# EasyEDA schematic sch_buttons.json
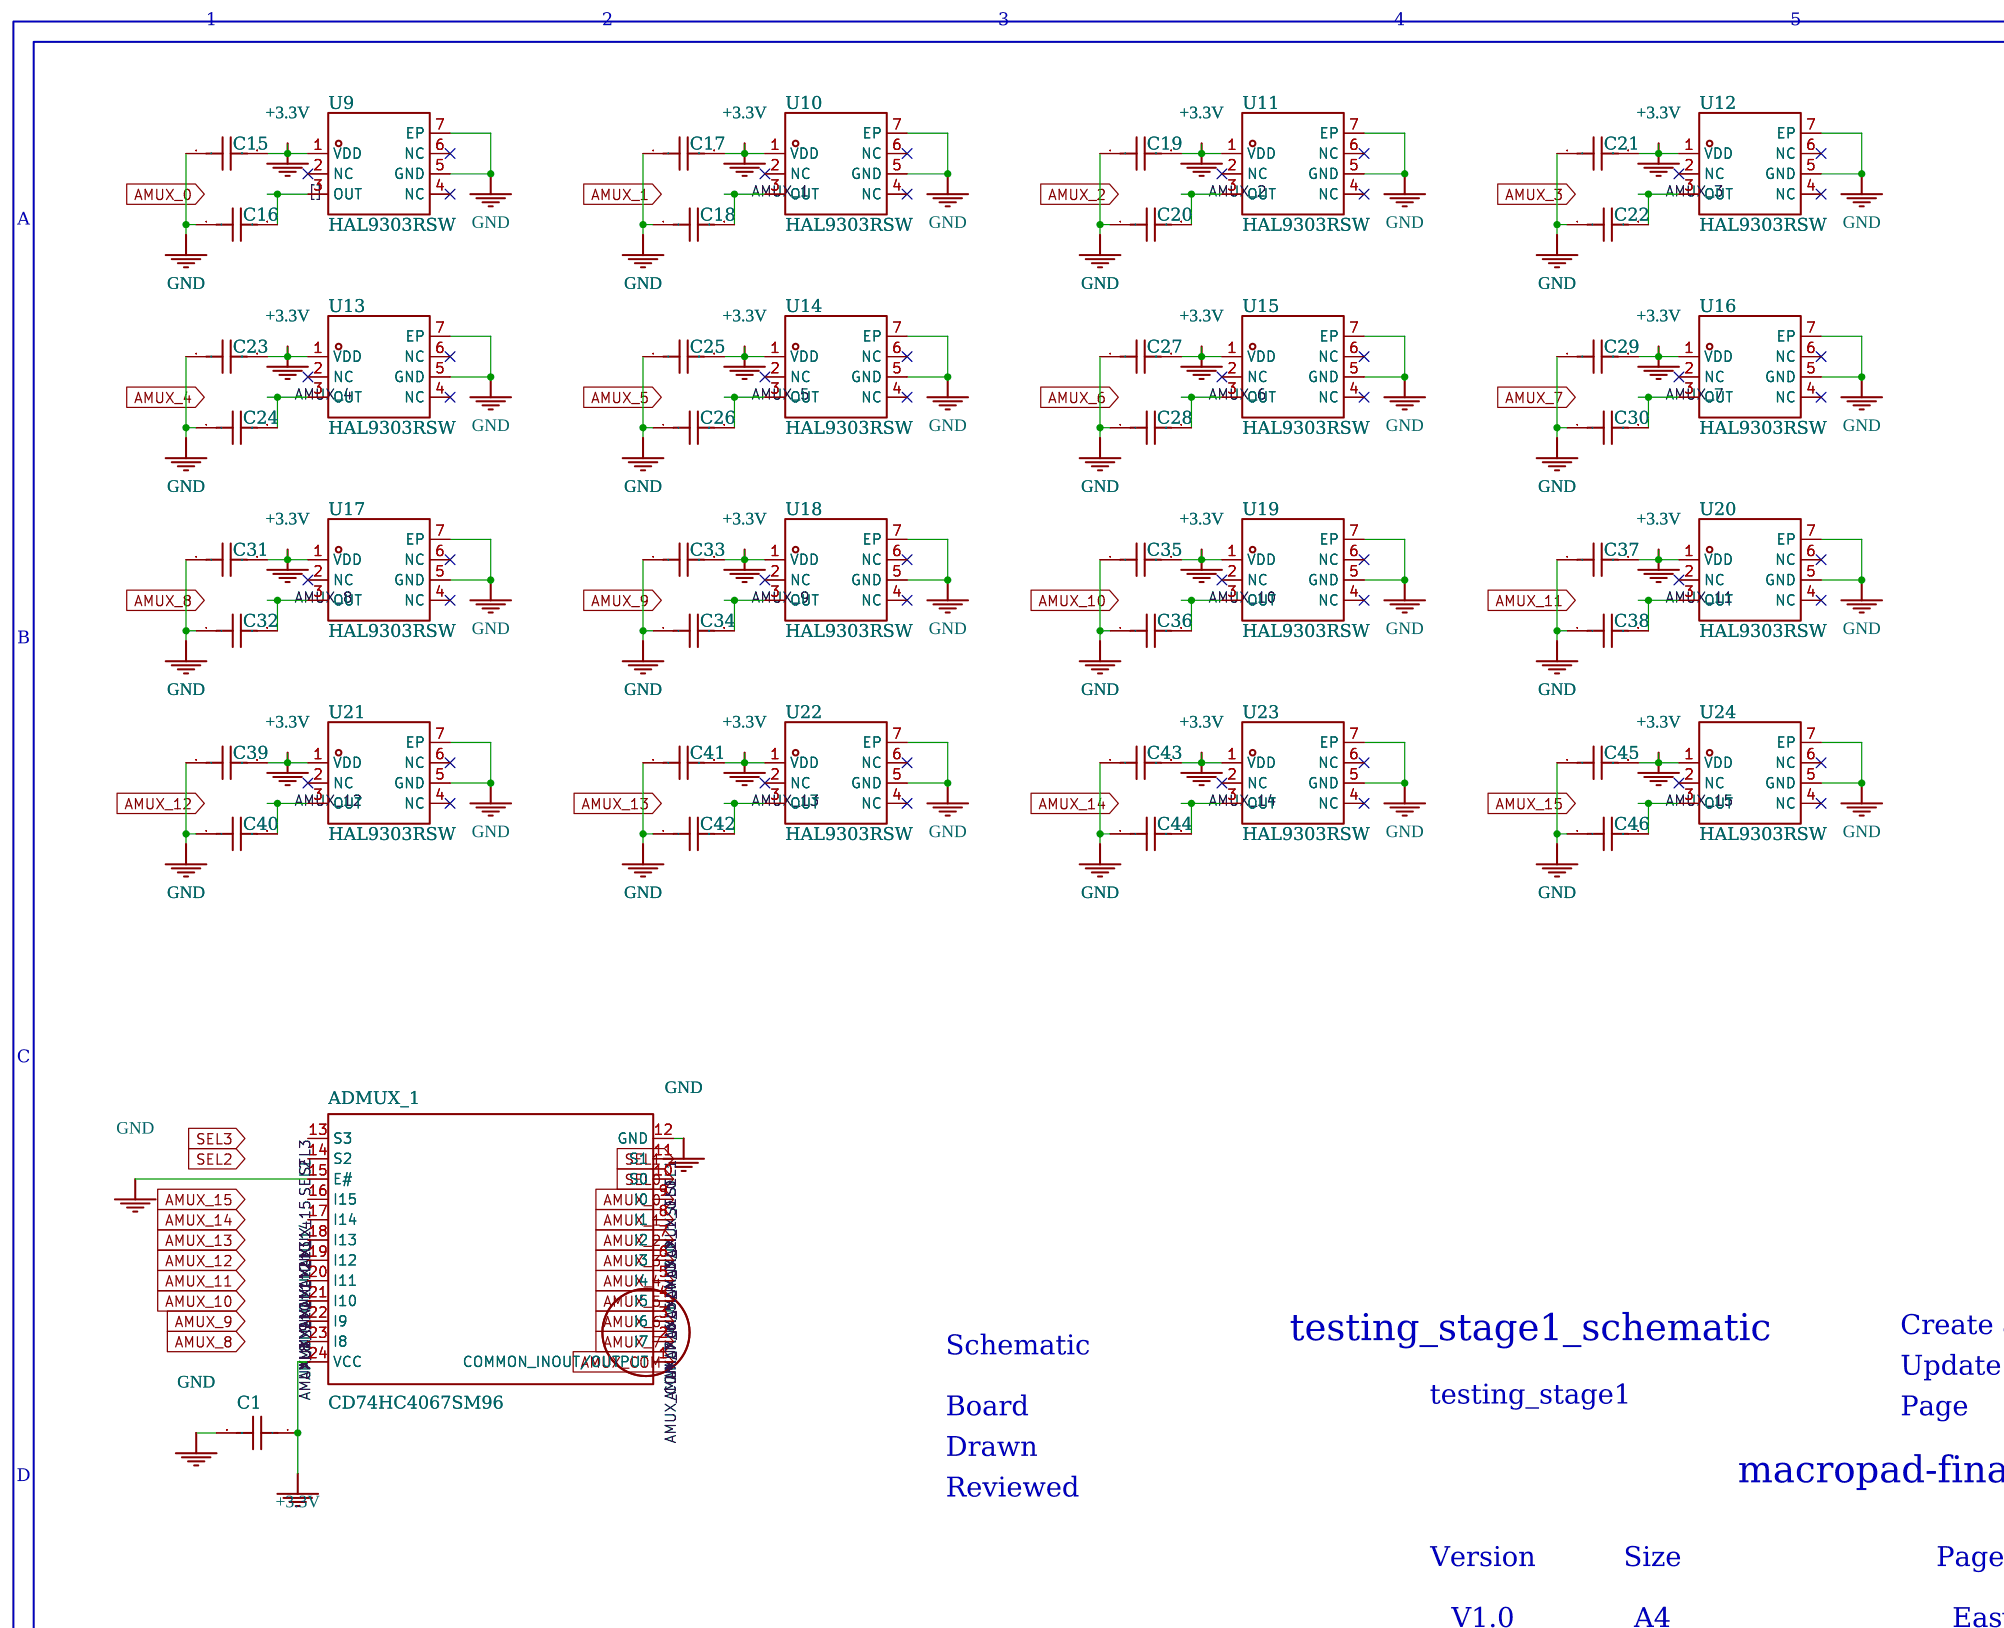
[diagram p0: schematic sheet]

## Parts
ADMUX_1  CD74HC4067SM96  [SSOP-24_L8.1-W5.3-P0.65-LS7.8-BL]
C1  100nF  [C0201]
C15  100nF  [C0201]
C16  100nF  [C0201]
C17  100nF  [C0201]
C18  100nF  [C0201]
C19  100nF  [C0201]
C20  100nF  [C0201]
C21  100nF  [C0201]
C22  100nF  [C0201]
C23  100nF  [C0201]
C24  100nF  [C0201]
C25  100nF  [C0201]
C26  100nF  [C0201]
C27  100nF  [C0201]
C28  100nF  [C0201]
C29  100nF  [C0201]
C30  100nF  [C0201]
C31  100nF  [C0201]
C32  100nF  [C0201]
C33  100nF  [C0201]
C34  100nF  [C0201]
C35  100nF  [C0201]
C36  100nF  [C0201]
C37  100nF  [C0201]
C38  100nF  [C0201]
C39  100nF  [C0201]
C40  100nF  [C0201]
C41  100nF  [C0201]
C42  100nF  [C0201]
C43  100nF  [C0201]
C44  100nF  [C0201]
C45  100nF  [C0201]
C46  100nF  [C0201]
U9  HAL9303RSW  [DFN1616-6_L1.6-W1.6-P0.50-BL-EP_RICOH_RP500X]
U10  HAL9303RSW  [DFN1616-6_L1.6-W1.6-P0.50-BL-EP_RICOH_RP500X]
U11  HAL9303RSW  [DFN1616-6_L1.6-W1.6-P0.50-BL-EP_RICOH_RP500X]
U12  HAL9303RSW  [DFN1616-6_L1.6-W1.6-P0.50-BL-EP_RICOH_RP500X]
U13  HAL9303RSW  [DFN1616-6_L1.6-W1.6-P0.50-BL-EP_RICOH_RP500X]
U14  HAL9303RSW  [DFN1616-6_L1.6-W1.6-P0.50-BL-EP_RICOH_RP500X]
U15  HAL9303RSW  [DFN1616-6_L1.6-W1.6-P0.50-BL-EP_RICOH_RP500X]
U16  HAL9303RSW  [DFN1616-6_L1.6-W1.6-P0.50-BL-EP_RICOH_RP500X]
U17  HAL9303RSW  [DFN1616-6_L1.6-W1.6-P0.50-BL-EP_RICOH_RP500X]
U18  HAL9303RSW  [DFN1616-6_L1.6-W1.6-P0.50-BL-EP_RICOH_RP500X]
U19  HAL9303RSW  [DFN1616-6_L1.6-W1.6-P0.50-BL-EP_RICOH_RP500X]
U20  HAL9303RSW  [DFN1616-6_L1.6-W1.6-P0.50-BL-EP_RICOH_RP500X]
U21  HAL9303RSW  [DFN1616-6_L1.6-W1.6-P0.50-BL-EP_RICOH_RP500X]
U22  HAL9303RSW  [DFN1616-6_L1.6-W1.6-P0.50-BL-EP_RICOH_RP500X]
U23  HAL9303RSW  [DFN1616-6_L1.6-W1.6-P0.50-BL-EP_RICOH_RP500X]
U24  HAL9303RSW  [DFN1616-6_L1.6-W1.6-P0.50-BL-EP_RICOH_RP500X]

## Library data of the parts
ADMUX_1 = -: LCSC Part Name: 高速CMOS逻辑16通道模拟多路复用器/解复用器; Supplier Part: C98457; Manufacturer: TI(德州仪器); Supplier Footprint: SSOP-24-208mil; JLCPCB Part Class: Extended Part; Datasheet: https://www.ti.com/cn/lit/gpn/cd74hc4067; Supplier: LCSC; Add into BOM: yes; Convert to PCB: yes; Number of Channels: 16; Supply Voltage: 2V6V; Turn-on time: 90ns; On-State Resistance (Max): 240Ω; Turn-off time: 87ns; Operating Temperature: -55℃+125℃
C1 C15-C46 = -: Symbol: TCC0201X7R104K160ZT; Device: TCC0201X7R104K160ZT; LCSC Part Name: 100nF ±10% 16V; Supplier Part: C18164586; Manufacturer: CCTC(三环); Manufacturer Part: TCC0201X7R104K160ZT; Supplier Footprint: 0201; JLCPCB Part Class: Extended Part; Datasheet: https://atta.szlcsc.com/upload/public/pdf/source/20191203/C466239_F62A586702D44EEA1C39B32FC8662B21.pdf; Supplier: LCSC; Add into BOM: yes; Convert to PCB: yes; Tolerance: ±10%; Voltage Rating: 16V; Temperature Coefficient: X7R
U9-U24 = -: Supplier Part: C42387472; Manufacturer: Hallwee(霍尔微电子); Supplier Footprint: DFN-6-EP(1.6x1.6); Datasheet: https://atta.szlcsc.com/upload/public/pdf/source/20241128/4D6AE4F8742D3C17AD5884A18EBEC5A8.pdf; Supplier: LCSC; Add into BOM: yes; Convert to PCB: yes

## Nets
+3.3V: ADMUX_1.24(VCC) C1.1 C15.2 C17.2 C19.2 C21.2 C23.2 C25.2 C27.2 C29.2 C31.2 C33.2 C35.2 C37.2 C39.2 C41.2 C43.2 C45.2 U9.1(VDD) U10.1(VDD) U11.1(VDD) U12.1(VDD) U13.1(VDD) U14.1(VDD) U15.1(VDD) U16.1(VDD) U17.1(VDD) U18.1(VDD) U19.1(VDD) U20.1(VDD) U21.1(VDD) U22.1(VDD) U23.1(VDD) U24.1(VDD)
GND: ADMUX_1.12(GND) ADMUX_1.15(E#) C1.2 C15.1 C16.1 C17.1 C18.1 C19.1 C20.1 C21.1 C22.1 C23.1 C24.1 C25.1 C26.1 C27.1 C28.1 C29.1 C30.1 C31.1 C32.1 C33.1 C34.1 C35.1 C36.1 C37.1 C38.1 C39.1 C40.1 C41.1 C42.1 C43.1 C44.1 C45.1 C46.1 U9.5(GND) U9.7(EP) U10.5(GND) U10.7(EP) U11.5(GND) U11.7(EP) U12.5(GND) U12.7(EP) U13.5(GND) U13.7(EP) U14.5(GND) U14.7(EP) U15.5(GND) U15.7(EP) U16.5(GND) U16.7(EP) U17.5(GND) U17.7(EP) U18.5(GND) U18.7(EP) U19.5(GND) U19.7(EP) U20.5(GND) U20.7(EP) U21.5(GND) U21.7(EP) U22.5(GND) U22.7(EP) U23.5(GND) U23.7(EP) U24.5(GND) U24.7(EP)
[]: C16.2 U9.3(OUT)
AMUX_0: ADMUX_1.9(I0)
AMUX_1: ADMUX_1.8(I1) C18.2 U10.3(OUT)
AMUX_2: ADMUX_1.7(I2) C20.2 U11.3(OUT)
AMUX_3: ADMUX_1.6(I3) C22.2 U12.3(OUT)
AMUX_4: ADMUX_1.5(I4) C24.2 U13.3(OUT)
AMUX_5: ADMUX_1.4(I5) C26.2 U14.3(OUT)
AMUX_6: ADMUX_1.3(I6) C28.2 U15.3(OUT)
AMUX_7: ADMUX_1.2(I7) C30.2 U16.3(OUT)
AMUX_8: ADMUX_1.23(I8) C32.2 U17.3(OUT)
AMUX_9: ADMUX_1.22(I9) C34.2 U18.3(OUT)
AMUX_10: ADMUX_1.21(I10) C36.2 U19.3(OUT)
AMUX_11: ADMUX_1.20(I11) C38.2 U20.3(OUT)
AMUX_12: ADMUX_1.19(I12) C40.2 U21.3(OUT)
AMUX_13: ADMUX_1.18(I13) C42.2 U22.3(OUT)
AMUX_14: ADMUX_1.17(I14) C44.2 U23.3(OUT)
AMUX_15: ADMUX_1.16(I15) C46.2 U24.3(OUT)
AMUX_COM: ADMUX_1.1(COMMON INOUT/OUTPUT)
SEL0: ADMUX_1.10(S0)
SEL1: ADMUX_1.11(S1)
SEL2: ADMUX_1.14(S2)
SEL3: ADMUX_1.13(S3)

Not connected (* = marked no-connect by the designer): U9 2(NC)* 4(NC)* 6(NC)*; U10 2(NC)* 4(NC)* 6(NC)*; U11 2(NC)* 4(NC)* 6(NC)*; U12 2(NC)* 4(NC)* 6(NC)*; U13 2(NC)* 4(NC)* 6(NC)*; U14 2(NC)* 4(NC)* 6(NC)*; U15 2(NC)* 4(NC)* 6(NC)*; U16 2(NC)* 4(NC)* 6(NC)*; U17 2(NC)* 4(NC)* 6(NC)*; U18 2(NC)* 4(NC)* 6(NC)*; U19 2(NC)* 4(NC)* 6(NC)*; U20 2(NC)* 4(NC)* 6(NC)*; U21 2(NC)* 4(NC)* 6(NC)*; U22 2(NC)* 4(NC)* 6(NC)*; U23 2(NC)* 4(NC)* 6(NC)*; U24 2(NC)* 4(NC)* 6(NC)*

## Notes on the sheet
- 1
- 2
- 3
- 4
- 5
- 6
- A
- A
- B
- B
- C
- C
- testing_stage1_schematic
- Create at
- 2025-03-28
- Schematic
- Update at
- 2025-03-29
- testing_stage1
- Board
- Page
- buttons
- Drawn
- macropad-final
- D
- Reviewed
- D
- Version
- Size
- Page  2  Total  2
- V1.0
- A4
- EasyEDA.com
- 1
- 2
- 3
- 4
- 5
- 6
